# EAGLE design main (EAGLE 9.6.2)
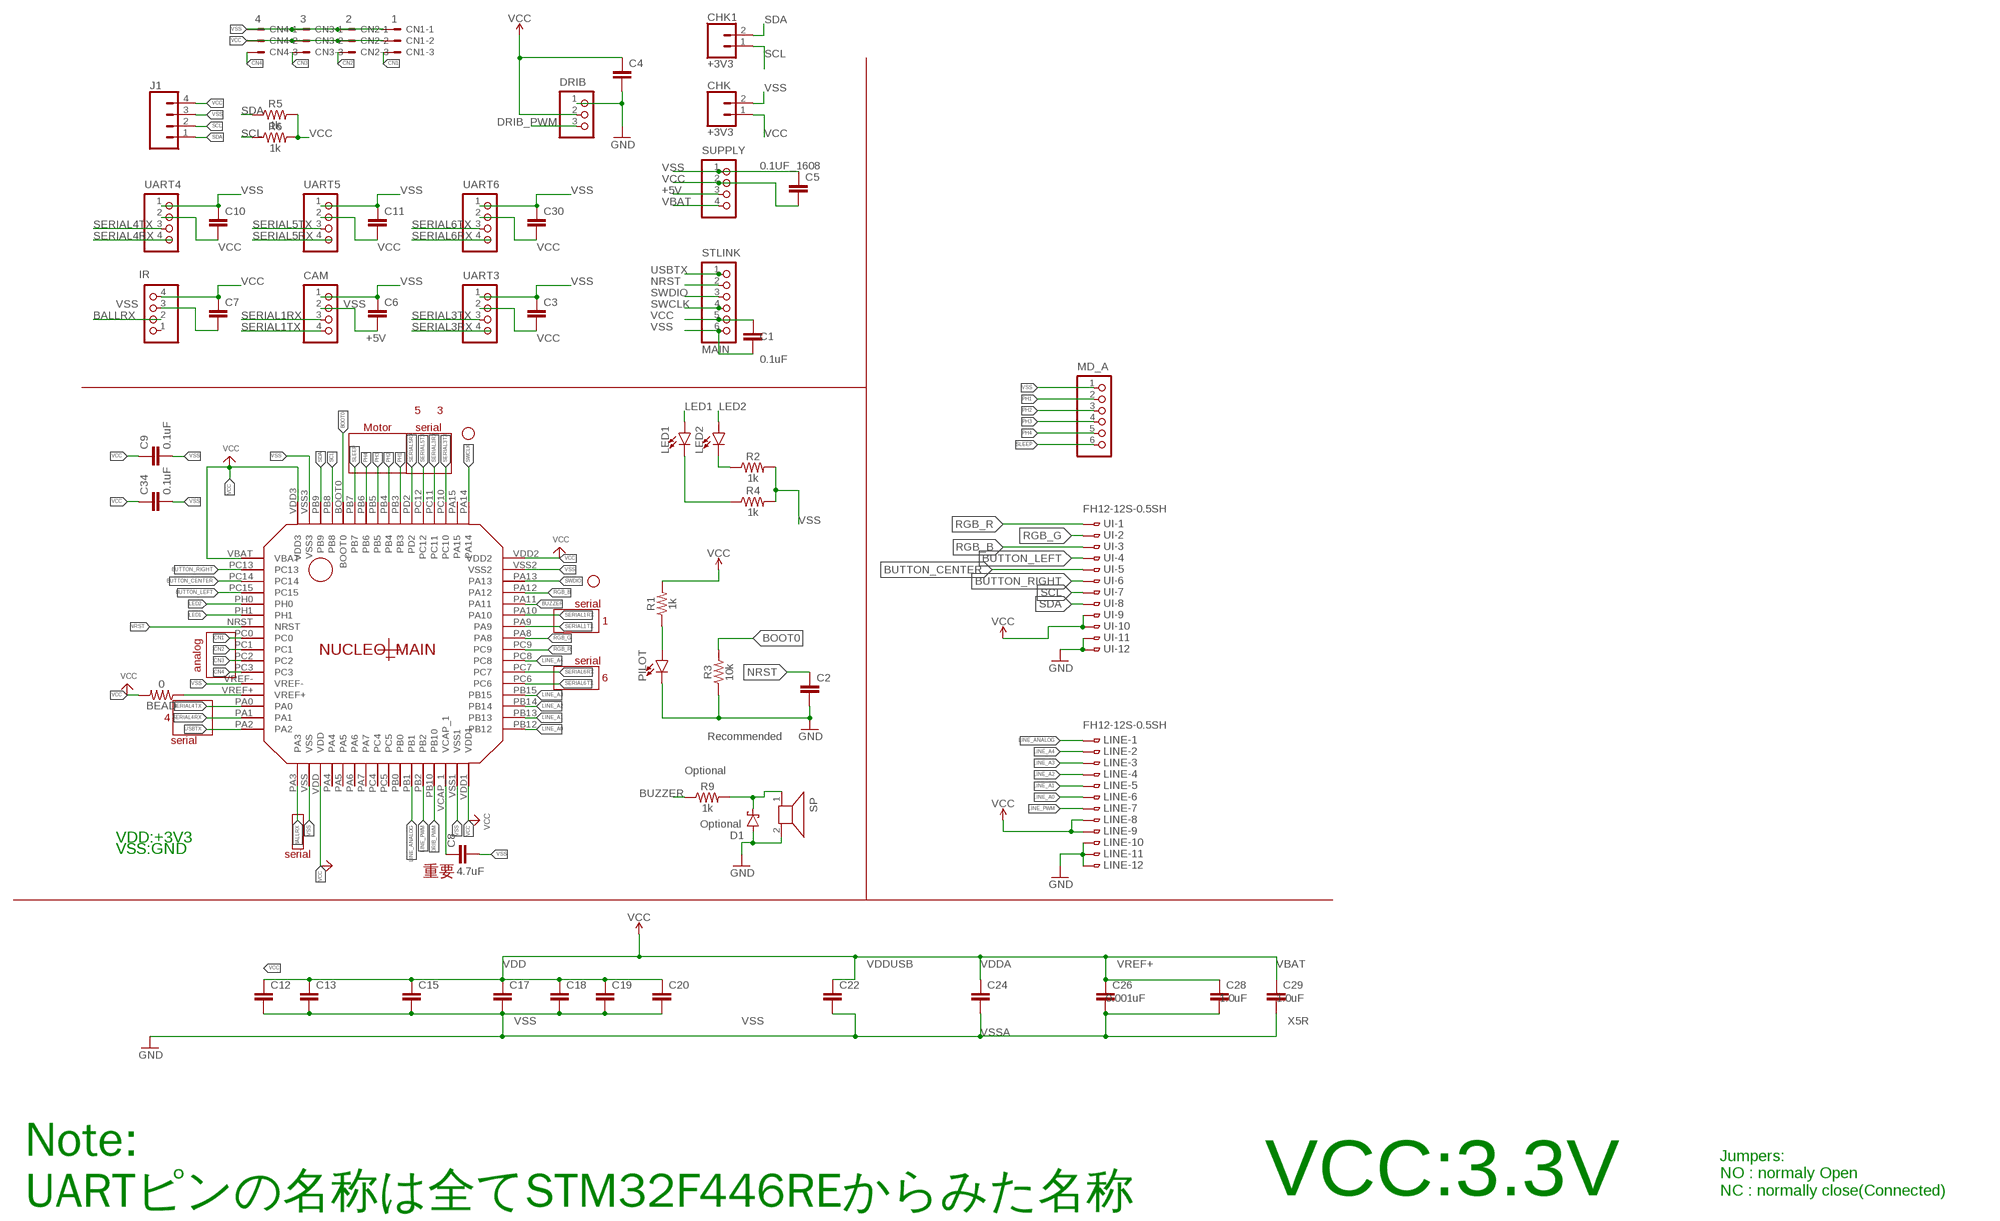
[diagram p0: schematic, sheet 1]

## Parts
BEAD  0  0OHM-0603-1/10W-5%  [0603]
C1  0.1uF  0.1UF_1608  [1608]
C2  0.1UF_1608  [1608]
C3  0.1UF_1608  [1608]
C4  0.1UF_1608  [1608]
C5  0.1UF_1608  [1608]
C6  0.1UF_1608  [1608]
C7  0.1UF_1608  [1608]
C8  4.7uF  0.1UF-0603-25V-(+80/-20%)  [0603]
C9  0.1uF  0.1UF-0603-25V-(+80/-20%)  [0603]
C10  0.1UF_1608  [1608]
C11  0.1UF_1608  [1608]
C12  0.1UF_1608  [1608]
C13  0.1UF_1608  [1608]
C15  0.1UF_1608  [1608]
C17  0.1UF_1608  [1608]
C18  0.1UF_1608  [1608]
C19  0.1UF_1608  [1608]
C20  0.1UF_1608  [1608]
C22  0.1UF_1608  [1608]
C24  0.1UF_1608  [1608]
C26  0.001UF_1608  [1608]
C28  1.0UF_1608  [1608]
C29  1.0UF_1608  [1608]
C30  0.1UF_1608  [1608]
C34  0.1uF  0.1UF-0603-25V-(+80/-20%)  [0603]
CAM  cam  B4B-XH-A  [B4B-XH-A]
CHK  +3V3  CONN_02  [1X02]
CHK1  +3V3  CONN_02  [1X02]
CN1  1  JST-XH-03-PIN-LONG-PAD  [JST-XH-03-PACKAGE-LONG-PAD]
CN2  2  JST-XH-03-PIN-LONG-PAD  [JST-XH-03-PACKAGE-LONG-PAD]
CN3  3  JST-XH-03-PIN-LONG-PAD  [JST-XH-03-PACKAGE-LONG-PAD]
CN4  4  JST-XH-03-PIN-LONG-PAD  [JST-XH-03-PACKAGE-LONG-PAD]
D1  DIODE-SS2040LFL  [SOD123FL]
DRIB  B3B-XH-A  [B3B-XH-A]
IR  IR  B4B-XH-A  [B4B-XH-A]
J1  CONN_04  [1X04]
LED1  LED-SMD  [LED-1206]
LED2  LED-SMD  [LED-1206]
LINE  FH12-12S-0.5SH  [FH12-12S-0.5SH]
MD_A  B6B-XH-A  [B6B-XH-A]
NUCLEO_MAIN  F446RET6  STM32F446RET6  [STM32F446RET6]
PILOT  LED-SMD  [LED-1206]
R1  1k  RESISTOR-0603-1/10W-1%  [R0603]
R2  1k  RESISTOR-0603-1/10W-1%  [R0603]
R3  10k  RESISTOR-0603-1/10W-1%  [R0603]
R4  1k  RESISTOR-0603-1/10W-1%  [R0603]
R5  1k  RESISTOR-0603-1/10W-1%  [R0603]
R6  1k  RESISTOR-0603-1/10W-1%  [R0603]
R9  1k  RESISTOR-0603-1/10W-1%  [R0603]
SP  PKLCS1212E4001  [PKLCS1212E4001]
STLINK  MAIN  B6B-XH-A  [B6B-XH-A]
SUPPLY  B4B-XH-A  [B4B-XH-A]
UART3  IMU  B4B-XH-A  [B4B-XH-A]
UART4  IMU  B4B-XH-A  [B4B-XH-A]
UART5  IMU  B4B-XH-A  [B4B-XH-A]
UART6  IMU  B4B-XH-A  [B4B-XH-A]
UI  FH12-12S-0.5SH  [FH12-12S-0.5SH]

## Nets
+5V: C6.2 CAM.2 SUPPLY.3
BALLRX: IR.2 NUCLEO_MAIN.PA3
BOOT0: NUCLEO_MAIN.BOOT0 R3.2
BUTTON_CENTER: NUCLEO_MAIN.PC14 UI.5
BUTTON_LEFT: NUCLEO_MAIN.PC15 UI.4
BUTTON_RIGHT: NUCLEO_MAIN.PC13 UI.6
BUZZER: NUCLEO_MAIN.PA11 R9.1
CN1: CN1.3 NUCLEO_MAIN.PC0
CN2: CN2.3 NUCLEO_MAIN.PC1
CN3: CN3.3 NUCLEO_MAIN.PC2
CN4: CN4.3 NUCLEO_MAIN.PC3
DRIB_PWM: DRIB.3 NUCLEO_MAIN.PB10
LED1: LED1.A NUCLEO_MAIN.PH1
LED2: LED2.A NUCLEO_MAIN.PH0
LINE_A0: LINE.6 NUCLEO_MAIN.PB12
LINE_A1: LINE.5 NUCLEO_MAIN.PB13
LINE_A2: LINE.4 NUCLEO_MAIN.PB14
LINE_A3: LINE.3 NUCLEO_MAIN.PB15
LINE_A4: LINE.2 NUCLEO_MAIN.PC8
LINE_ANALOG: LINE.1 NUCLEO_MAIN.PB1
LINE_PWM: LINE.7 NUCLEO_MAIN.PB2
N$1: LED2.C R2.1
N$2: LED1.C R4.1
NRST: C2.1 NUCLEO_MAIN.NRST STLINK.2
PH1: MD_A.2 NUCLEO_MAIN.PB3
PH2: MD_A.3 NUCLEO_MAIN.PB4
PH3: MD_A.4 NUCLEO_MAIN.PB5
PH4: MD_A.5 NUCLEO_MAIN.PB6
POWERLED_RESISTOR: PILOT.A R1.1
RGB_B: NUCLEO_MAIN.PA12 UI.3
RGB_G: NUCLEO_MAIN.PA8 UI.2
RGB_R: NUCLEO_MAIN.PC9 UI.1
SCL: CHK1.1 J1.2 NUCLEO_MAIN.PB8 R6.1 UI.7
SDA: CHK1.2 J1.1 NUCLEO_MAIN.PB9 R5.1 UI.8
SERIAL1RX: CAM.3 NUCLEO_MAIN.PA10
SERIAL1TX: CAM.4 NUCLEO_MAIN.PA9
SERIAL3RX: NUCLEO_MAIN.PC11 UART3.4
SERIAL3TX: NUCLEO_MAIN.PC10 UART3.3
SERIAL4RX: NUCLEO_MAIN.PA1 UART4.4
SERIAL4TX: NUCLEO_MAIN.PA0 UART4.3
SERIAL5RX: NUCLEO_MAIN.PD2 UART5.4
SERIAL5TX: NUCLEO_MAIN.PC12 UART5.3
SERIAL6RX: NUCLEO_MAIN.PC7 UART6.4
SERIAL6TX: NUCLEO_MAIN.PC6 UART6.3
SLEEP: MD_A.6 NUCLEO_MAIN.PB7
SP: D1.C R9.2 SP.1
SWCLK: NUCLEO_MAIN.PA14 STLINK.4
SWDIO: NUCLEO_MAIN.PA13 STLINK.3
USBTX: NUCLEO_MAIN.PA2 STLINK.1
VBAT: SUPPLY.4
VCAP: C8.1 NUCLEO_MAIN.VCAP_1
VCC: BEAD.2 C1.1 C3.2 C4.1 C5.2 C7.1 C9.1 C10.2 C11.2 C12.1 C13.1 C15.1 C17.1 C18.1 C19.1 C20.1 C22.1 C24.1 C26.1 C28.1 C29.1 C30.2 C34.1 CHK.1 CN1.2 CN2.2 CN3.2 CN4.2 DRIB.2 IR.4 J1.4 LINE.8 LINE.9 NUCLEO_MAIN.VBAT NUCLEO_MAIN.VDD NUCLEO_MAIN.VDD1 NUCLEO_MAIN.VDD2 NUCLEO_MAIN.VDD3 R1.2 R5.2 R6.2 STLINK.5 SUPPLY.2 UART3.2 UART4.2 UART5.2 UART6.2 UI.9 UI.10
VDDA: BEAD.1 NUCLEO_MAIN.VREF+
VSS: C1.2 C2.2 C3.1 C4.2 C5.1 C6.1 C7.2 C8.2 C9.2 C10.1 C11.1 C12.2 C13.2 C15.2 C17.2 C18.2 C19.2 C20.2 C22.2 C24.2 C26.2 C28.2 C29.2 C30.1 C34.2 CAM.1 CHK.2 CN1.1 CN2.1 CN3.1 CN4.1 D1.A DRIB.1 IR.3 J1.3 LINE.10 LINE.11 LINE.12 MD_A.1 NUCLEO_MAIN.VREF- NUCLEO_MAIN.VSS NUCLEO_MAIN.VSS1 NUCLEO_MAIN.VSS2 NUCLEO_MAIN.VSS3 PILOT.C R2.2 R3.1 R4.2 SP.2 STLINK.6 SUPPLY.1 UART3.1 UART4.1 UART5.1 UART6.1 UI.11 UI.12 ; supply symbol labelled GND
Unconnected: IR.1 NUCLEO_MAIN.PA4 NUCLEO_MAIN.PA5 NUCLEO_MAIN.PA6 NUCLEO_MAIN.PA7 NUCLEO_MAIN.PA15 NUCLEO_MAIN.PB0 NUCLEO_MAIN.PC4 NUCLEO_MAIN.PC5

## Notes on the sheet
- 5 | 3
- Motor | serial
- serial
- 1
- serial
- analog
- 6
- 4
- serial | Recommended
- VDD:+3V3
- VSS:GND | serial
- 重要
- VDD | VDDUSB | VDDA | VREF+ | VBAT
- VSS | VSS
- VSSA
- VCC:3.3V
- Jumpers:
  NO : normaly Open
  NC : normally close(Connected)
- Note:
  UARTピンの名称は全てSTM32F446REからみた名称

## Library data of the parts
BEAD = SparkFun-Resistors:0OHM: 0Ω resistor A resistor is a passive two-terminal electrical component that implements electrical resistance as a circuit element. Resistors act to reduce current flow, and, at the same time, act to lower voltage levels within circuits. - Wikipedia; PROD_ID: RES-08609
C1-C7 C10-C13 C15 C17-C20 C22 C24 C30 = Custom_Designed_By_Yusei:0.1UF_1608
C8 = SparkFun-Capacitors:0.1UF: 0.1µF ceramic capacitors A capacitor is a passive two-terminal electrical component used to store electrical energy temporarily in an electric field.; PROD_ID: CAP-00810; VALUE: 0.1uF
C9 C34 = SparkFun-Capacitors:0.1UF: 0.1µF ceramic capacitors A capacitor is a passive two-terminal electrical component used to store electrical energy temporarily in an electric field.; PROD_ID: CAP-00810
C26 = Custom_Designed_By_Yusei:0.001UF_1608: 0.001uF Ceramic Capacitor A capacitor is a passive two-terminal electrical component used to store electrical energy temporarily in an electric field. Package is 0603(EIA), 1608(JIS); CAPACITY: 0.001uF
C28 = Custom_Designed_By_Yusei:1.0UF_1608; CAPACITY: 1.0uF
C29 = Custom_Designed_By_Yusei:1.0UF_1608; CAPACITY: 1.0uF; SPECIFICATION: X5R
CAM IR SUPPLY UART3-UART6 = jst-xh:B4B-XH-A: Wire-to-Board 2.5mm pitch top mount connector Source: http://www.jst-mfg.com/product/pdf/jpn/XH.pdf http://www.jst-mfg.com/product/detail.php?series=277
CHK CHK1 = SparkFun-Connectors:CONN_02: Multi connection point. Often used as Generic Header-pin footprint for 0.1 inch spaced/style header connections On any of the 0.1 inch spaced packages, you can populate with these: Break Away Headers - Straight <https://www.sparkfun.com/products/116> (PRT-00116) Break Away Male Headers - Right Angle <https://www.sparkfun.com/products/553> (PRT-00553) Female Headers <https://www.sparkfun.com/products/115> (PRT-00115) Break Away Headers - Machine Pin <https://www.sparkfun.com/products/117> (PRT-00117) Break Away Female Headers - Swiss Machine Pin <https://www.sparkfun.com/products/743> (PRT-00743) For SCREWTERMINALS and SPRING TERMINALS visit here: Screw Terimnals on SparkFun.com <https://www.sparkfun.com/search/results?term=Screw+Terminals> (5mm/3.5mm/2.54mm spacing) This device is also useful as a general connection point to wire up your design to another part of your project. Our various solder wires solder well into these plated through hole pads. Hook-Up Wire - Assortment (Stranded, 22 AWG) <https://www.sparkfun.com/products/11375> (PRT-11375) Hook-Up Wire - Assortment (Solid Core, 22 AWG) <https://www.sparkfun.com/products/11367> (PRT-11367) View the entire wire category on our website here <https://www.sparkfun.com/categories/141> Special notes: Molex polarized connector foot print use with: PRT-08233 with associated crimp pins and housings. 2.54_SCREWTERM for use with PRT-10571. 3.5mm Screw Terminal footprints for PRT-08084 5mm Screw Terminal footprints for use with PRT-08432
CN1-CN4 = JST XH Connectors:JST-XH-03-PIN: JST XH Connector 2 Pin Wire to board connector. Pitch: 2,54 mm, (0.100") Number of pins: 3 Created by Rembrandt Electronics www.rembrandtelectronics.com
D1 = Custom_Designed_By_Yusei:DIODE-SS2040LFL; CATEGORY: Optional
DRIB = jst-xh:B3B-XH-A: Wire-to-Board 2.5mm pitch top mount connector Source: http://www.jst-mfg.com/product/pdf/jpn/XH.pdf http://www.jst-mfg.com/product/detail.php?series=277
J1 = SparkFun-Connectors:CONN_04: Multi connection point. Often used as Generic Header-pin footprint for 0.1 inch spaced/style header connections On any of the 0.1 inch spaced packages, you can populate with these: Break Away Headers - Straight <https://www.sparkfun.com/products/116> (PRT-00116) Break Away Male Headers - Right Angle <https://www.sparkfun.com/products/553> (PRT-00553) Female Headers <https://www.sparkfun.com/products/115> (PRT-00115) Break Away Headers - Machine Pin <https://www.sparkfun.com/products/117> (PRT-00117) Break Away Female Headers - Swiss Machine Pin <https://www.sparkfun.com/products/743> (PRT-00743) For SCREWTERMINALS and SPRING TERMINALS visit here: Screw Terimnals on SparkFun.com <https://www.sparkfun.com/search/results?term=Screw+Terminals> (5mm/3.5mm/2.54mm spacing) This device is also useful as a general connection point to wire up your design to another part of your project. Our various solder wires solder well into these plated through hole pads. Hook-Up Wire - Assortment (Stranded, 22 AWG) <https://www.sparkfun.com/products/11375> (PRT-11375) Hook-Up Wire - Assortment (Solid Core, 22 AWG) <https://www.sparkfun.com/products/11367> (PRT-11367) View the entire wire category on our website here <https://www.sparkfun.com/categories/141> Special notes: Molex polarized connector foot print use with SKU : PRT-08231 with associated crimp pins and housings. 1MM SMD Version SKU: PRT-10208; PROD_ID: CONN-09696
LED1 LED2 PILOT = Custom_Designed_By_Yusei:LED-SMD
LINE UI = con-hirose:FH12-12S-0.5S: 0.5mm Pitch Connectors For FPC/FFC Source: Data sheet <http://www.hirose.co.jp/cataloge_hp/e58605370.pdf>; MPN: FH12-12S-0.5SH(55); OC_FARNELL: 1324542; OC_NEWARK: 34M6155
MD_A STLINK = jst-xh:B6B-XH-A: Wire-to-Board 2.5mm pitch top mount connector Source: http://www.jst-mfg.com/product/pdf/jpn/XH.pdf http://www.jst-mfg.com/product/detail.php?series=277
NUCLEO_MAIN = STM32F446RET6:STM32F446RET6
R1 R2 R4-R6 = Custom_Designed_By_Yusei:RESISTOR: Resistor; PROD_ID: RES-07856
R3 = Custom_Designed_By_Yusei:RESISTOR: Resistor; PROD_ID: RES-07856; VALUE: 1k
R9 = Custom_Designed_By_Yusei:RESISTOR: Resistor; CATEGORY: Optional; PROD_ID: RES-07856
SP = pklcs1212e4001-r1:PKLCS1212E4001

## Net classes
0 default: width 0.3 mm
1 GND: width 0.32 mm
2 +3V3: width 0.32 mm

## Board
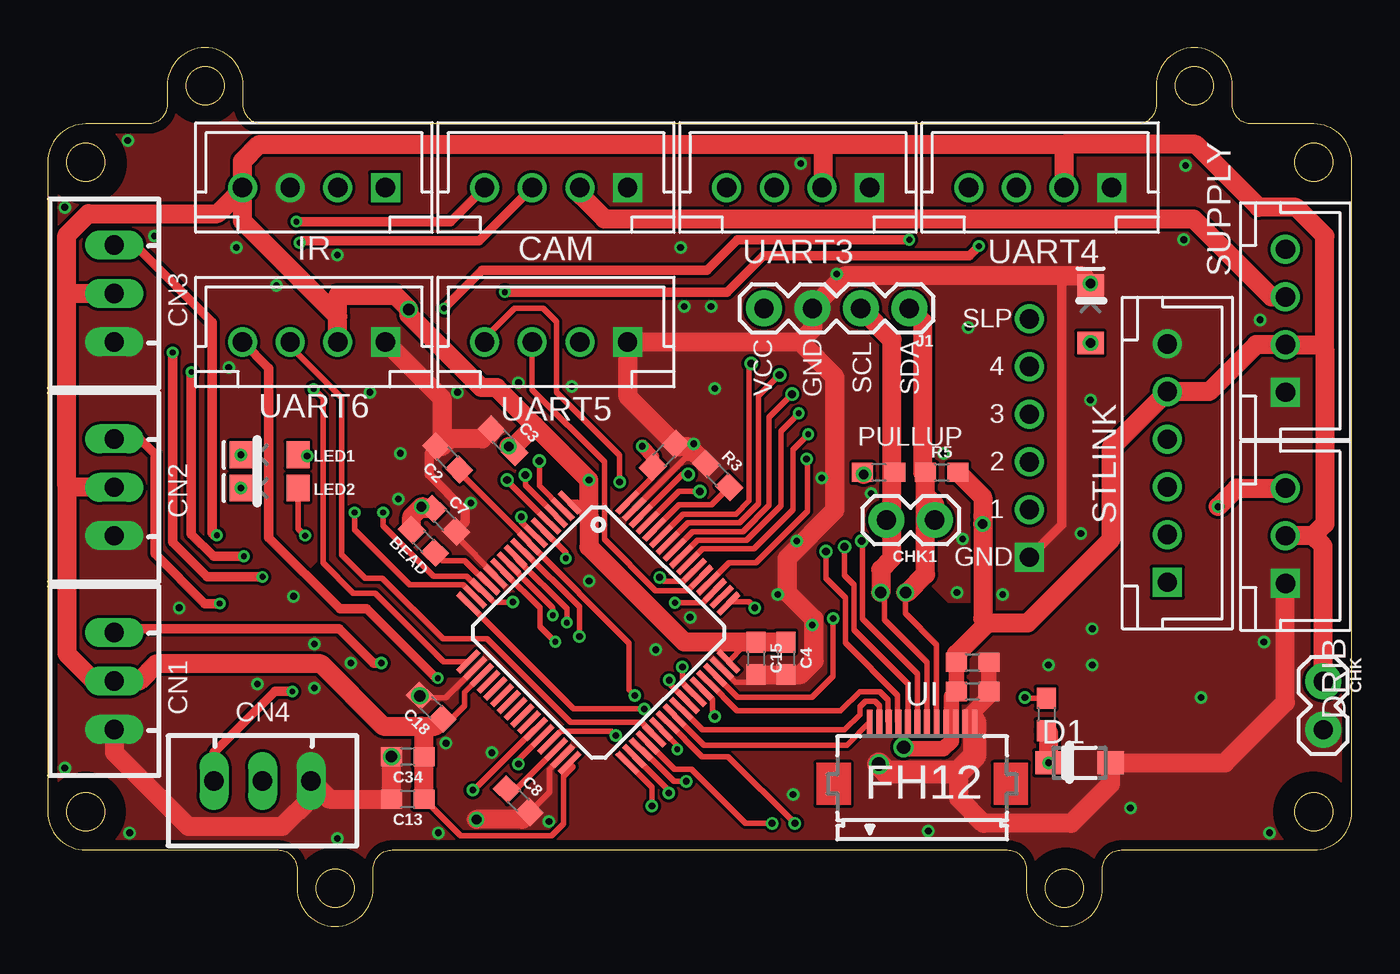
[diagram p1: board, top side]
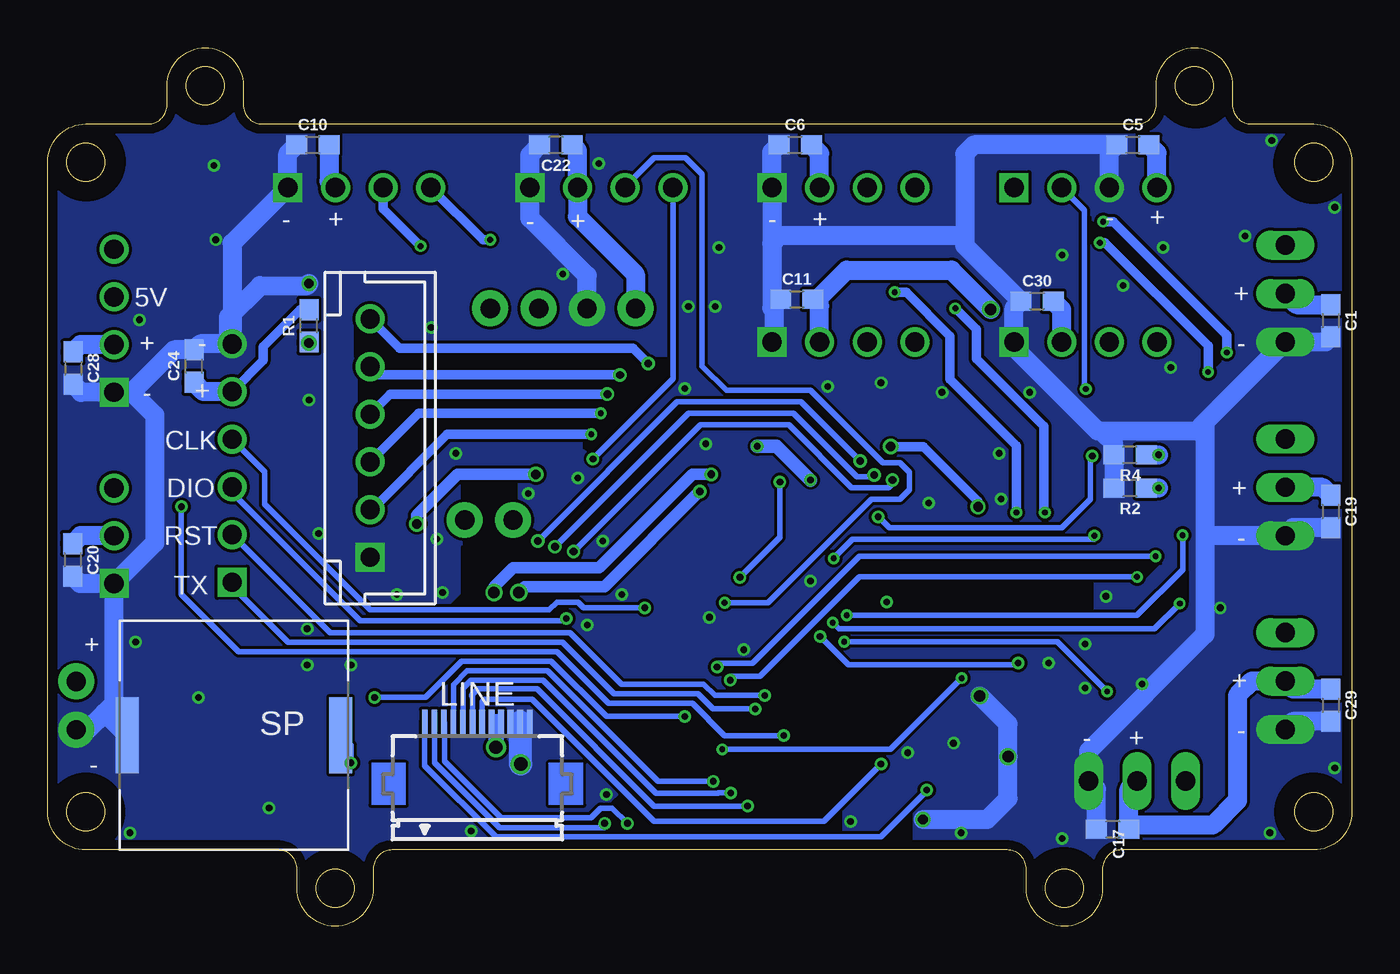
[diagram p2: board, bottom side, seen from below]

Size 68.42 x 46.07 mm. Coordinates in mm from the lower left corner, seen from the top.
Outline: 50.34,4 arc-90 51.34,3 51.34,2 arc180 55.34,2 55.34,3 arc-90 56.34,4 66.42,4 arc90 68.42,6 68.42,40.07 arc90 66.42,42.07 63.15,42.07 arc-90 62.15,43.07 62.15,44.07 arc180 58.15,44.07 58.15,43.07 arc-90 57.15,42.07 34.21,42.07 11.26,42.07 arc-90 10.26,43.07 10.26,44.07 arc180 6.26,44.07 6.26,43.07 arc-90 5.26,42.07 2,42.07 arc90 0,40.07 0,6 arc90 2,4 12.08,4 arc-90 13.08,3 13.08,2 arc180 17.08,2 17.08,3 arc-90 18.08,4 34.21,4 50.34,4
Outline: circle at 2,6 radius 1
Outline: circle at 2,40.07 radius 1
Outline: circle at 66.42,6 radius 1
Outline: circle at 66.42,40.07 radius 1
Outline: circle at 8.26,44.07 radius 1
Outline: circle at 60.15,44.07 radius 1
Outline: circle at 15.08,2 radius 1
Outline: circle at 53.34,2 radius 1
Copper layers (1*16): Top 0.035mm / dielectric 1.6mm / Bottom 0.035mm
Design rules "Elecrow_2-layer_PCB_eagle_rule": minimum track width 6mil, minimum drill 12mil, track to track 6mil, track to pad 6mil, pad to pad 6mil, via to via 8mil, smd to smd 0mil, copper to edge 20mil, drill to drill 10mil, minimum pad ring 6mil, minimum via ring 6mil, stop-mask expansion 0mil, vias tented up to drill 100mil, thermal gap 10mil
tRestrict: area -0.1,3.9 to 4.1,8.1; area 13,-0.1 to 17.2,4.1; area 51.3,-0.1 to 55.5,4.1; area 64.3,3.9 to 68.5,8.1; area 64.4,38.1 to 68.4,42.1; area 58.1,42.1 to 62.1,46.1; area 6.2,42.1 to 10.2,46.1; area -0.1,37.9 to 4.1,42.1; 6 lines
bRestrict: area -0.1,37.9 to 4.1,42.1; area 6.1,41.9 to 10.3,46.1; area 58.2,42.1 to 62.2,46.1; area 64.4,38.1 to 68.4,42.1; area 64.4,4 to 68.4,8; area 51.4,0 to 55.4,4; area 13,-0.1 to 17.2,4.1; area 0,4 to 4,8; 30 lines

### Footprints (pad centres in the part's own frame; a part is rotated, then mirrored left to right if it is on the bottom)
0603 = smd 1.1 x 1: 1 -0.85,0; 2 0.85,0
1608 = smd 1.1 x 1: 1 -0.85,0; 2 0.85,0
B4B-XH-A = drill 1.016 square: 1 -3.75,0 | drill 1.016: 2 -1.25,0; 3 1.25,0; 4 3.75,0
1X02 = drill 1.016 pad 1.88: 1 0,0; 2 2.54,0
JST-XH-03-PACKAGE-LONG-PAD = drill 1.016 long: 1 -2.54,0; 2 0,0; 3 2.54,0
SOD123FL = smd 1.397 x 1.22: A 1.625,0; C -1.625,0
B3B-XH-A = drill 1.016 square: 1 -2.5,0 | drill 1.016: 2 0,0; 3 2.5,0
1X04 = drill 1.016 pad 1.88: 1 0,0; 2 2.54,0; 3 5.08,0; 4 7.62,0
LED-1206 = smd 1.2 x 1.4: A -1.5,0; C 1.5,0
FH12-12S-0.5SH = smd 0.3 x 1.3: 1 -2.75,3.25; 2 -2.25,3.25; 3 -1.75,3.25; 4 -1.25,3.25; 5 -0.75,3.25; 6 -0.25,3.25; 7 0.25,3.25; 8 0.75,3.25; 9 1.25,3.25; 10 1.75,3.25; 11 2.25,3.25; 12 2.75,3.25
B6B-XH-A = drill 1.016 square: 1 -6.25,0 | drill 1.016: 2 -3.75,0; 3 -1.25,0; 4 1.25,0; 5 3.75,0; 6 6.25,0
STM32F446RET6 = smd 0.3 x 1.5: BOOT0 -1.75,5.9; PA3 -3.75,-5.9; PA4 -2.25,-5.9; PA5 -1.75,-5.9; PA6 -1.25,-5.9; PA7 -0.75,-5.9; PA14 3.75,5.9; PA15 3.25,5.9; PB0 0.75,-5.9; PB1 1.25,-5.9; PB2 1.75,-5.9; PB3 0.75,5.9; PB4 0.25,5.9; PB5 -0.25,5.9; PB6 -0.75,5.9; PB7 -1.25,5.9; PB8 -2.25,5.9; PB9 -2.75,5.9; PB10 2.25,-5.9; PC4 -0.25,-5.9; PC5 0.25,-5.9; PC10 2.75,5.9; PC11 2.25,5.9; PC12 1.75,5.9; PD2 1.25,5.9; VCAP_1 2.75,-5.9; VDD -2.75,-5.9; VDD1 3.75,-5.9; VDD3 -3.75,5.9; VSS -3.25,-5.9; VSS1 3.25,-5.9; VSS3 -3.25,5.9 | smd 1.5 x 0.3: NRST -5.9,0.75; PA0 -5.9,-2.75; PA1 -5.9,-3.25; PA2 -5.9,-3.75; PA8 5.9,0.25; PA9 5.9,0.75; PA10 5.9,1.25; PA11 5.9,1.75; PA12 5.9,2.25; PA13 5.9,2.75; PB12 5.9,-3.75; PB13 5.9,-3.25; PB14 5.9,-2.75; PB15 5.9,-2.25; PC0 -5.9,0.25; PC1 -5.9,-0.25; PC2 -5.9,-0.75; PC3 -5.9,-1.25; PC6 5.9,-1.75; PC7 5.9,-1.25; PC8 5.9,-0.75; PC9 5.9,-0.25; PC13 -5.9,3.25; PC14 -5.9,2.75; PC15 -5.9,2.25; PH0 -5.9,1.75; PH1 -5.9,1.25; VBAT -5.9,3.75; VDD2 5.9,3.75; VREF+ -5.9,-2.25; VREF- -5.9,-1.75; VSS2 5.9,3.25
R0603 = smd 1.1 x 1: 1 -0.85,0; 2 0.85,0
PKLCS1212E4001 = smd 1.2 x 4: 1 -5.6,0; 2 5.6,0

### Placement (x,y rotation side)
BEAD  19.7,20.18 135 top
C1  1.11,31.75 270 bottom
C2  20.98,24.56 135 top
C3  23.89,25.45 315 top
C4  38.72,14.05 270 top
C5  11.49,40.97 0 bottom
C6  29.21,40.97 0 bottom
C7  20.81,21.3 315 top
C8  24.68,6.58 315 top
C9  32.34,24.68 45 top
C10  54.51,40.97 0 bottom
C11  29.11,32.88 0 bottom
C12  48.52,13.84 0 top
C13  18.89,6.67 180 top
C15  37.15,14.05 270 top
C17  12.54,5.08 180 bottom
C18  20.12,11.48 135 top
C19  1.11,21.75 270 bottom
C20  67.11,19.21 270 bottom
C22  41.75,40.97 180 bottom
C24  60.73,29.37 90 bottom
C26  48.52,12.31 0 top
C28  67.08,29.27 270 bottom
C29  1.11,11.59 270 bottom
C30  16.51,32.77 0 bottom
C34  18.89,8.89 180 top
CAM  26.67,38.73 180 top
CHK  66.91,12.84 270 top
CHK1  44,21.3 0 top
CN1  3.49,12.86 90 top
CN2  3.49,23.02 90 top
CN3  3.49,33.18 90 top
CN4  11.27,7.62 180 top
D1  54.13,8.57 0 top
DRIB  64.93,20.48 90 top
IR  13.97,38.73 180 top
J1  45.2,32.4 180 top
LED1  11.63,24.72 180 top
LED2  11.63,22.98 180 top
LINE  45.88,7.46 0 bottom
MD_A  51.5,25.6 90 bottom
NUCLEO_MAIN  28.89,15.4 315 top
PILOT  54.7,32.09 90 top
R1  54.7,31.49 90 bottom
R2  11.63,22.98 180 bottom
R3  35.16,23.64 315 top
R4  11.63,24.72 180 bottom
R5  46.9,23.8 0 top
R6  43.6,23.8 180 top
R9  52.39,11.11 270 top
SP  58.64,10.02 180 bottom
STLINK  58.74,24.29 90 top
SUPPLY  64.93,31.75 90 top
UART3  39.37,38.73 180 top
UART4  52.07,38.73 180 top
UART5  26.67,30.64 180 top
UART6  13.97,30.64 180 top
UI  45.88,7.46 0 top

### Tracks (layer width: path | path; a pad name or v marks a point on that pad's centre or on a via)
+5V
  Top 1: CAM.2 28,38.66 28,38.3 29.2,37.1 60.1,37.1 64.2,33 SUPPLY.3
  Bottom 1: CAM.2 27.92,40.53 C6.2
BALLRX  (via drill 0.3)
  Top 0.3: v13.95,28.17 14.45,27.67 14.45,19.05 16.03,17.47 17.17,17.47 20.77,13.88 NUCLEO_MAIN.PA3
  Bottom 0.3: v13.95,28.17 14.02,28.25 14.02,37.55 15.15,38.68 IR.2
BOOT0
  Top 0.3: NUCLEO_MAIN.BOOT0 33.12,22.1 34.81,22.1 R3.2
BUTTON_CENTER  (via drill 0.4)
  Top 0.3: UI.5 45.13,12.7 42.29,15.54 42.29,17.91 41.8,18.4 v41.8,19.9 | v25.06,23.66 25.06,23.12 NUCLEO_MAIN.PC14
  Bottom 0.3: v41.8,19.9 34.8,26.9 29.3,26.9 25.96,23.56 25.16,23.56 v25.06,23.66
BUTTON_LEFT  (via drill 0.4)
  Top 0.3: UI.4 44.58,10.76 44.58,12.11 41.84,14.85 41.84,17.23 40.83,18.24 v40.83,19.64 | v24.1,23.4 24.1,23.37 NUCLEO_MAIN.PC15
  Bottom 0.3: v24.1,23.4 24.1,23.2 24.3,23 26.24,23 29.54,26.3 34.17,26.3 v40.83,19.64
BUTTON_RIGHT  (via drill 0.4)
  Top 0.3: UI.6 45.63,13.24 42.74,16.13 42.74,20.16 v42.7,20.2 | v25.8,24.4 | v25.8,24.4 25.8,23.09 NUCLEO_MAIN.PC13
  Bottom 0.3: v42.7,20.2 35.4,27.5 28.9,27.5 v25.8,24.4
BUZZER  (via drill 0.35)
  Top 0.3: R9.1 51.3,11.96 v51.26,12 | NUCLEO_MAIN.PA11 34.34,12.46 34.89,11.91 34.89,11.11 v35,11
  Bottom 0.3: v51.26,12 48.6,12 46.7,13.9 42,13.9 39.1,11 v35,11
CN1  (via drill 0.35)
  Top 0.3: v27.9,15.2 27.9,16.74 NUCLEO_MAIN.PC0
  Top 0.5: CN1.3 3.69,15.6 15.3,15.6 17.1,13.8 v17.5,13.8
  Bottom 0.3: v27.9,15.2 26.4,13.7 17.6,13.7 v17.5,13.8
CN2  (via drill 0.3)
  Top 0.3: v27.23,15.92 27.23,16.65 24.66,19.23 NUCLEO_MAIN.PC1
  Top 0.5: CN2.3 4.82,25.56 5.63,24.75 5.63,19.52 8.23,16.92 v9.03,16.92
  Bottom 0.3: v9.03,16.92 10.35,15.6 26.91,15.6 v27.23,15.92
CN3  (via drill 0.3)
  Top 0.3: NUCLEO_MAIN.PC2 24.19,19.01 26.5,16.71 v26.5,16.31
  Top 0.5: CN3.3 4.59,35.72 8.64,31.67 8.64,20.6 8.73,20.51 v8.88,20.51
  Bottom 0.3: v26.5,16.31 11.28,16.31 8.88,18.71 v8.88,20.51
CN4  (via drill 0.3)
  Top 0.3: v26.63,14.92 25.83,15.72 25.83,16.7 23.98,18.55 NUCLEO_MAIN.PC3
  Top 0.5: CN4.3 8.73,9.12 11.92,12.31 v12.84,12.31
  Bottom 0.3: v26.63,14.92 15.45,14.92 v12.84,12.31
DRIB_PWM  (via drill 0.35)
  Top 0.3: v29.8,10 29.58,10.22 26.9,10.22 NUCLEO_MAIN.PB10 | 64.8,22.98 DRIB.3
  Top 1: v61.4,22 62.38,22.98 64.8,22.98
  Bottom 0.3: v61.4,22 61.4,17.4 58.4,14.4 41.7,14.4 39,11.7 34.6,11.7 32.9,10 v29.8,10
LED1  (via drill 0.35)
  Top 0.3: LED1.A 13.56,24.72 v13.62,24.67 | NUCLEO_MAIN.PH1 24.84,21.22 v24.84,21.47
  Bottom 0.3: v13.62,24.67 13.71,24.57 13.71,22.38 15.2,20.9 24.27,20.9 v24.84,21.47
LED2  (via drill 0.3)
  Top 0.3: LED2.A 13.13,20.86 v13.51,20.48 | NUCLEO_MAIN.PH0 27.18,19.58 v27.18,19.29
  Bottom 0.3: v27.18,19.29 26.19,20.28 13.51,20.28 v13.51,20.48
LINE_A0  (via drill 0.35)
  Top 0.3: v31.7,6.3 31.7,7.29 NUCLEO_MAIN.PB12
  Bottom 0.3: LINE.6 46.13,12.03 46.18,12.08 46.18,12.1 45.83,12.45 42.75,12.45 36.6,6.3 v31.7,6.3
LINE_A1  (via drill 0.35)
  Top 0.3: v32.59,6.99 32.59,7.11 NUCLEO_MAIN.PB13
  Bottom 0.3: LINE.5 46.63,12.47 46.2,12.9 42.44,12.9 36.51,6.97 33.24,6.97 33.22,6.99 v32.59,6.99
LINE_A2  (via drill 0.35)
  Top 0.3: NUCLEO_MAIN.PB14 31.19,9.28 32.87,7.6 v33.5,7.6
  Bottom 0.3: LINE.4 47.13,12.67 46.4,13.4 42.2,13.4 36.4,7.6 v33.5,7.6
LINE_A3  (via drill 0.35)
  Top 0.3: NUCLEO_MAIN.PB15 32.87,8.24 33.76,8.24 36.6,5.4 v38,5.4
  Bottom 0.3: LINE.3 47.58,10.66 47.58,8.66 44.62,5.7 39.9,5.7 39.4,6.2 38.8,6.2 v38,5.4
LINE_A4  (via drill 0.35)
  Top 0.3: v39.2,5.4 35.7,8.9 34.33,8.9 NUCLEO_MAIN.PC8
  Bottom 0.3: LINE.2 48.13,8.57 44.71,5.15 39.2,5.15 v39.2,5.4
LINE_ANALOG  (via drill 0.35)
  Top 0.3: v22.3,7.14 22.34,7.14 25.54,10.34 NUCLEO_MAIN.PB1
  Bottom 0.3: LINE.1 48.63,8.43 44.9,4.7 24.7,4.7 22.3,7.1 v22.3,7.14
LINE_PWM  (via drill 0.35)
  Top 0.3: v24.7,8.5 24.7,8.73 NUCLEO_MAIN.PB2
  Bottom 0.3: LINE.7 45.63,11.77 45.5,11.9 43,11.9 36.6,5.5 27.7,5.5 v24.7,8.5
N$1  (via drill 0.35)
  Bottom 1: LED2.C R2.1
  other vias: 10.13,22.98
N$2  (via drill 0.35)
  Bottom 1: R4.1 LED1.C
  other vias: 10.13,24.72
NRST  (via drill 0.35)
  Top 0.3: C2.1 21.52,23.9 25.25,20.17 NUCLEO_MAIN.NRST 30.5,14.85 30.5,12.4 v30.8,12.1
  Bottom 0.3: v30.8,12.1 33.4,12.1 34,12.7 38.3,12.7 41,15.4 53.6,15.4 STLINK.2
PH1  (via drill 0.3 pad 0.4)
  Top 0.3: NUCLEO_MAIN.PB3 34.34,19.79 37.05,19.79 39.1,21.84 39.1,25 v39.9,25.8
  Bottom 0.5: MD_A.2 51.4,21.85 47.45,25.8 v39.9,25.8
PH2  (via drill 0.3 pad 0.4)
  Top 0.3: NUCLEO_MAIN.PB4 34.09,20.24 36.66,20.24 38.46,22.04 38.46,25.96 v39.4,26.9
  Bottom 0.5: v39.4,26.9 48.95,26.9 MD_A.3
PH3  (via drill 0.4)
  Top 0.3: NUCLEO_MAIN.PB5 33.84,20.7 36.48,20.7 37.85,22.07 37.85,26.7 v39.05,27.9
  Bottom 0.5: v39.05,27.9 50.45,27.9 MD_A.4
PH4  (via drill 0.4)
  Top 0.3: NUCLEO_MAIN.PB6 33.58,21.15 36.29,21.15 37.29,22.15 37.29,27.81 v38.39,28.91
  Bottom 0.5: v38.39,28.91 51.06,28.91 MD_A.5
POWERLED_RESISTOR  (via drill 0.5)
  Bottom 1: PILOT.A R1.1
  other vias: 54.7,30.59
RGB_B
  Top 0.3: UI.3 44.08,10.76 44.08,11.87 43.66,12.3 42.6,12.3 41.6,11.3 36.17,11.3 NUCLEO_MAIN.PA12
RGB_G
  Top 0.3: NUCLEO_MAIN.PA8 34.34,10.3 41.8,10.3 42.6,11.1 42.6,11.5 42.9,11.8 43.4,11.8 43.63,11.57 UI.2
RGB_R
  Top 0.3: NUCLEO_MAIN.PC9 34.44,9.5 41.92,9.5 UI.1
SCL  (via drill 0.4, 0.6)
  Top 0.3: NUCLEO_MAIN.PB8 33.11,22.8 v34.2,22.8 | v43.7,17.5 43.9,17.3 43.9,16.07 46.13,13.84 UI.7
  Top 1: v43.7,17.5 43.7,18.7 44.3,19.3 44.3,21.3 CHK1.1 44.3,21.6 44.3,23.8 | 44.3,23.8 44.3,30.76 J1.2 | R6.1 44.3,23.8
  Bottom 0.6: v34.2,22.8 v34.21,22.8 39.2,17.8 43.4,17.8 v43.7,17.5
SDA  (via drill 0.4, 0.6)
  Top 0.3: v33.6,23.7 33.3,23.7 NUCLEO_MAIN.PB9 | UI.8 46.63,14.77 45,16.4 v45,17.5
  Top 1: v45,17.5 45.1,17.5 46.05,18.45 46.05,22.6 | J1.1 45.9,31.7 45.9,23.8 R5.1 46.05,22.6 | CHK1.2 46.54,22.11 46.05,22.6
  Bottom 0.6: v33.6,23.7 34.6,23.7 39.5,18.8 44,18.8 45,17.8 v45,17.5
SERIAL1RX  (via drill 0.3, 0.35)
  Top 0.3: NUCLEO_MAIN.PA10 33.3,12.76 v33.3,13.6
  Top 0.5: v13.22,35.84 13.32,35.94 22.63,35.94 CAM.3 | v10.29,19.4 8.7,19.4 7.54,20.56 v7.54,29.06
  Bottom 0.3: v10.29,19.4 25.84,19.4 31.44,13.8 33.25,13.8 v33.3,13.6
  Bottom 0.5: v7.54,29.06 7.54,30.44 12.94,35.84 v13.22,35.84
SERIAL1TX  (via drill 0.3, 0.35)
  Top 0.3: NUCLEO_MAIN.PA9 32.6,12.75 v32.6,12.9 | 13.2,36.95 v13.05,36.95
  Top 0.5: CAM.4 21.13,36.95 13.2,36.95 | v11.27,18.32 8.38,18.32 6.56,20.14 v6.56,30.09
  Bottom 0.3: v11.27,18.32 25.84,18.32 31.04,13.12 32.57,13.12 v32.6,12.9 | 6.63,31.06 6.56,30.99
  Bottom 0.5: v13.05,36.95 12.52,36.95 6.63,31.06 | 6.56,30.99 v6.56,30.09
SERIAL3RX  (via drill 0.35)
  Top 0.3: NUCLEO_MAIN.PC11 35.74,19.07 37.16,19.07 39.85,21.76 39.85,24.47 v39.81,24.51
  Bottom 0.3: UART3.4 35.62,28.7 v39.81,24.51
SERIAL3TX  (via drill 0.3)
  Top 0.3: v32.9,16.96 34.38,16.96 34.84,17.42 NUCLEO_MAIN.PC10
  Bottom 0.3: v32.9,16.96 30.64,16.96 25.2,22.4 23.7,22.4 23.2,22.9 23.2,23.8 23.7,24.3 24.6,24.3 28.41,28.11 32.82,28.11 34.08,29.37 34.08,39.43 34.96,40.31 36.6,40.31 38,38.91 UART3.3
SERIAL4RX  (via drill 0.3 pad 0.4)
  Top 0.3: NUCLEO_MAIN.PA1 21.8,17.9 19,17.9 16.1,20.8 v16.1,21.7
  Top 0.5: v45.2,36 36.2,36 34.6,34.4 22.8,34.4 v20.8,32.4
  Bottom 0.5: UART4.4 45.59,36 v45.2,36 | v20.8,32.4 19.7,31.3 19.7,29.75 16.17,26.22 16.17,21.77 v16.1,21.7
SERIAL4TX  (via drill 0.3, 0.3 pad 0.4, 0.35)
  Top 0.3: v24.4,17 23.4,17 NUCLEO_MAIN.PA0 22.71,17.63 21.98,18.35 20.25,18.35 17.6,21 v17.6,21.7
  Top 0.5: v48.85,35.67 48.35,35.17 37.56,35.17 35.65,33.25 v23.98,33.25
  Bottom 0.5: UART4.3 50.82,37.63 v48.85,35.67 | v23.98,33.25 23.38,33.25 21.07,30.95 21.07,28.67 17.6,25.2 v17.6,21.7
SERIAL5RX  (via drill 0.35)
  Top 0.3: NUCLEO_MAIN.PD2 33.36,18.1 32.3,18.1 v32.1,18.3 | UART5.4 22.92,30.84 24.48,32.4 26,32.4 26.7,31.7 26.7,28 30,24.7 v30,23.3
  Bottom 0.3: v30,23.3 30,20.4 v32.1,18.3
SERIAL5TX
  Top 0.3: NUCLEO_MAIN.PC12 33.56,17.59 32.7,17.59 32.7,17.6 31.9,17.6 29.2,20.3 29.2,24.36 25.42,28.14 UART5.3
SERIAL6RX  (via drill 0.3)
  Top 0.3: v33.02,9.27 33.02,9.5 32.35,10.18 NUCLEO_MAIN.PC7
  Top 0.5: v20.47,13.01 20.37,13.01 16.74,16.64 15.34,16.64 11.6,20.38 11.6,29.26 UART6.4
  Bottom 0.3: v33.02,9.27 24.2,9.27 v20.47,13.01
SERIAL6TX
  Top 0.3: UART6.3 12.72,30.41 15.43,27.7 15.43,19.47 16.65,18.25 17.55,18.25 20.74,15.06 23.06,15.06 27.44,10.69 31.16,10.69 31.67,10.18 NUCLEO_MAIN.PC6
SLEEP  (via drill 0.4)
  Top 0.3: NUCLEO_MAIN.PB7 33.33,21.6 36.1,21.6 36.8,22.3 36.8,29.4 v36.9,29.5
  Bottom 0.5: v36.9,29.5 37.7,30.3 49.95,30.3 MD_A.6
SP  (via drill 0.35)
  Top 1: R9.2 52.51,10.14 D1.C
  Bottom 0.3: SP.1 52.51,9.48 D1.C
  other vias: 52.51,8.57
SWCLK  (via drill 0.35)
  Top 0.3: v37.1,16.7 36.78,17.02 35.82,17.02 NUCLEO_MAIN.PA14
  Bottom 0.3: v37.1,16.7 37.5,16.7 40.3,16.7 40.6,17 41.7,17 42.1,16.6 51.5,16.6 57.04,22.14 57.04,23.84 STLINK.4
SWDIO  (via drill 0.35)
  Top 0.3: NUCLEO_MAIN.PA13 35.03,13.17 36.2,12 40.1,12 41.2,13.1 v41.2,16.13
  Bottom 0.3: v41.2,16.13 41.3,16.03 52.03,16.03 58.74,22.74 STLINK.3
USBTX  (via drill 0.35)
  Top 0.3: NUCLEO_MAIN.PA2 27.59,11.4 v31.3,11.4
  Bottom 0.3: v31.3,11.4 33.5,11.4 34.3,12.2 38.7,12.2 41.4,14.9 55.8,14.9 58.74,17.83 STLINK.1
VCAP
  Top 0.3: NUCLEO_MAIN.VCAP_1 24.57,7.19 C8.1
VCC  (via drill 0.35, 0.5, 0.6, 0.7)
  Top 0.3: NUCLEO_MAIN.VDD 21.88,12.27 21.88,11.57 21.19,10.88 C18.1 | UI.10 47.4,10.71 UI.9 | NUCLEO_MAIN.VDD3 31.74,23.55 C9.1 31.64,24.18 31.64,24.2 31.74,24.3 | NUCLEO_MAIN.VDD2 36.54,14.7 36.95,14.7 C15.1 | NUCLEO_MAIN.VDD1 27.57,8.37 27.07,7.87 27.07,5.37 26.44,4.74 21.67,4.74 C13.1 | NUCLEO_MAIN.VBAT 27.78,22.22 28.4,21.6 | v49.05,21.1 49,21.5 49.05,21.5
  Top 0.7: v31.2,25.17 31.74,24.63 31.74,24.3
  Top 0.8: C12.1 C26.1 47.4,12.04 47.4,10.71 47.4,9.7 47,9.3 44.98,9.3 v44.9,9.38
  Top 1: CN3.2 1.29,33.18 1.01,32.9 | 1.01,23.1 1.01,32.9 | 1.01,23.1 1.01,14.29 2.44,12.86 CN1.2 4.79,12.86 5.69,13.76 14.34,13.76 17.6,10.5 19.6,10.5 | CN2.2 1.09,23.02 1.01,23.1 | 19.6,10.5 20.34,10.5 C18.1 | C13.1 C34.1 19.74,10.36 19.6,10.5 | BEAD.2 19.1,21.49 v19.61,22 19.71,22 19.81,21.9 C7.1 | 1.01,32.9 1.01,36.24 2.13,37.36 8.92,37.36 10.22,38.66 | 10.22,38.66 IR.4 10.22,40.12 11.1,41 40.7,41 | 40.7,41 40.7,38.81 UART3.2 | 40.7,41 53.3,41 | UART4.2 53.32,40.98 53.3,41 | UART6.2 15.22,31.98 | 15.22,31.98 15.22,33.08 18.22,33.08 v18.95,32.35 18.95,32.05 22.75,28.24 23.55,28.24 25.55,26.25 | 10.22,38.66 10.22,36.98 15.22,31.98 | 67,30.2 67,21.1 66.38,20.48 | 66.38,20.48 DRIB.2 | 67,30.2 66.7,30.5 SUPPLY.2 63.4,30.5 60.94,28.04 STLINK.5 55.8,25.1 55.8,20.3 51.4,15.9 49.3,15.9 | CHK.1 66.91,19.94 66.38,20.48 | C15.1 C4.1 33.4,14.9 28.4,19.9 28.4,21.6 v28.4,23.4 25.55,26.25 | 67,30.2 67,36.2 65.5,37.7 63.53,37.7 60.23,41 53.3,41 | v24.19,25.15 C3.2 24.49,25.19 25.55,26.25 | C12.1 47.67,14.27 49.3,15.9 | R6.2 42.75,23.75 v42.8,23.7 | R5.2 49.05,22.5 49.05,21.5 v49.05,21.1 49.05,16.15 49.3,15.9
  Bottom 0.3: LINE.9 44.9,10.71 LINE.8
  Bottom 0.5: v24.19,25.15 22.47,25.15 19.61,22.3 v19.61,22 | R1.2 55.16,32.34 57.1,30.4 57.1,29.68 STLINK.5
  Bottom 0.6: v42.8,23.7 46.9,23.7 49.05,21.55 v49.05,21.1
  Bottom 0.7: v28.4,23.4 30.17,25.17 v31.2,25.17
  Bottom 0.8: 44.9,10.71 v44.9,9.38
  Bottom 1: CN3.2 2.91,32.6 C1.1 | C19.1 1.53,23.02 CN2.2 | C29.1 3.07,12.44 CN1.2 5.24,12.86 6,12.1 6,6.6 7.3,5.3 11.47,5.3 C17.1 11.69,7.2 CN4.2 | IR.4 10.22,40.55 C5.2 | UART6.2 15.22,32.34 C30.2 | C11.2 27.92,32.53 UART5.2 27.92,32.98 26.5,34.4 21,34.4 v18.95,32.35 | C22.1 40.62,40.69 UART3.2 40.62,37.22 37.58,34.18 J1.4 | C10.2 53.66,39.08 UART4.2 | STLINK.5 60.25,28.04 C24.1 | SUPPLY.2 66.7,30.5 C28.1 | DRIB.2 66.69,20.48 C20.1
VDDA
  Top 0.3: NUCLEO_MAIN.VREF+ 23.06,17.98 21.88,19.16 20.72,19.16 BEAD.1
VSS  (via drill 0.35, 0.5, 0.6, 0.7)
  Top 0.3: C8.2 26.33,7.03 26.33,8.24 NUCLEO_MAIN.VSS1 | NUCLEO_MAIN.VSS 20.88,11.98 19.62,11.98 C18.2 | C7.2 21.41,20.47 23.48,18.4 NUCLEO_MAIN.VREF- | NUCLEO_MAIN.VSS3 33.44,24.54 34.25,24.54 R3.1 | UI.12 48.4,10.71 UI.11 | C15.2 37.15,12.9 37.05,12.8 36.09,12.8 NUCLEO_MAIN.VSS2
  Top 0.5: C2.2 20,24.78 20,23.7 21.9,21.8 21.9,21.18 C7.2 | 53.2,34.09 53.2,21.05 MD_A.1
  Top 0.8: 48.4,10.71 48.4,11.1 49.37,12.07 C26.2 C12.2
  Top 1: CN1.1 3.49,9.12 7.39,5.22 12.31,5.22 13.81,6.72 CN4.1 14.76,6.67 C13.2 C34.2 | DRIB.1 64.93,11.74 61.76,8.57 D1.A 55.76,7.46 53.7,5.4 49.1,5.4 47.8,6.7 47.8,8.1 | C2.2 20.68,25.16 | 20.68,25.16 21.07,25.55 22.79,25.55 C3.1 | UART6.1 20.68,27.68 20.68,25.16 | UART5.1 30.42,27.8 C9.2 33.08,25.14 33.65,25.14 R3.1 | C15.2 C4.2 39.5,13.2 40.2,13.9 40.2,16.1 38.8,17.5 38.8,19.31 41.3,21.81 41.3,28.8 39.46,30.64 | UART5.1 30.42,30.54 | 53.2,34.09 54.2,34.09 PILOT.C v54.7,33.7 54.3,34.1 41.8,34.1 40.1,32.4 | C8.2 24.9,5.6 v22.5,5.6 | 40.28,32.4 J1.3 40.12,31.3 39.46,30.64 | UART5.1 39.46,30.64
  Top 1.2: v43.6,8.5 44,8.1 47.8,8.1 48.63,8.93 UI.12
  Bottom 0.3: LINE.12 LINE.11 LINE.10
  Bottom 1: C1.2 1.37,30.64 CN3.1 7.7,26.43 | C19.2 3.07,20.9 CN2.1 7.58,20.48 7.7,20.6 | C29.2 3.07,10.74 CN1.1 | C17.2 13.39,7.2 CN4.1 13.81,9.19 7.7,15.3 7.7,20.6 | IR.3 12.72,40.59 C5.1 19.83,40.97 20.3,40.5 20.3,36.2 | C30.1 17.72,32.41 UART6.1 17.72,30.36 13.33,25.97 13.13,25.97 | C30.1 | 30.32,32.52 30.32,30.74 UART5.1 | 30.32,32.52 30.42,32.41 30.42,35.8 | 30.32,32.52 C11.1 | C6.1 30.42,40.61 CAM.1 30.42,35.8 | C22.2 43.12,40.45 UART3.1 43.12,37.12 40.12,34.12 J1.3 | C10.1 55.82,40.51 UART4.1 58.74,35.82 STLINK.6 | STLINK.6 60.41,30.54 C24.2 61.78,30.22 64,28 | 64,28 SUPPLY.1 66.66,28 C28.2 | C20.2 66.73,17.98 DRIB.1 | SP.2 65.43,11.2 | DRIB.1 64.93,11.7 65.43,11.2 | 64,28 62.8,26.8 62.8,20.11 DRIB.1 | R2.2 R4.2 12.48,25.32 13.13,25.97 | v54.7,33.7 54.8,33.6 57.28,33.6 58.94,31.94 58.94,30.74 STLINK.6 | CHK.2 66.33,10.3 65.43,11.2 | C18.2 18.04,10.61 C34.2 18.04,6.69 19.13,5.6 v22.5,5.6 | 7.7,26.43 7.7,20.6 | C30.1 20.3,35.7 20.3,36.2 | 7.7,26.43 8.16,25.97 13.13,25.97 | 20.3,36.2 30.02,36.2 30.42,35.8
  Bottom 1.2: LINE.11 43.63,9.92 43.62,9.91 43.62,8.52 v43.6,8.5
  other vias: 18.04,8.89 19.52,12.08 33.4,32.5 34.8,32.5 41.4,34.2 47.7,17.5 54.8,15.6 54.8,13.7 52.5,13.7 20.5,4.9 4.3,4.9 0.9,8.3 5.6,36.2 12,33.6 15.2,35.2 33.2,35.6 38.3,17.4 64.1,4.9 59.7,39.9 59.6,36 33.9,25.3 33.7,16.2 31.9,14.5 28.4,18.1 23.3,9.1 15.9,13.8 14,14.8 14,12.5 11,12.7 20.9,9.6 18.4,22.4 24.7,28.5 27.5,28.3 35,28.2 40.6,23.5 63.6,31.8 56.8,6.2 60.5,12 46.2,5 39.1,6.9 26.3,5.5 16.9,28 39.5,40 22.2,22.2 18.5,24.8 21.5,28 9.5,29.3 6.9,16.7 12.9,17.3 0.9,37.7 4.2,41.2 9.9,35.6 47,24.8 48,20.3 43.2,22.7 39.3,20.2 54.7,27.6 54.2,20.6 50.1,17.4 40.1,15.8 63.8,14.9 48.3,31.4 15.2,4.6
  pour Bottom (no thermals): -4.4,47.1 -4.4,-0.7 72.9,-0.7 72.9,47.1
  pour Top (no thermals): -0.8,46.5 -0.8,-1.6 72.4,-1.6 72.4,46.5

### Text on the board
tPlace: SLP | VCC | GND | SCL | SDA | 4 | 3 | PULLUP | 2 | 1 | GND | FH12
bPlace: + | - | + | - | + | - | + | - | + | 5V | - | - | + | + | - | CLK | + | DIO | - | RST | TX | + | + | - | + | - | -